# Altium schematic sheet RS422_point_to_point.SchDoc: MODBUS RS485
size A4; Date: *******; ApprovedBy: *******; CheckedBy: None; Author: *******; CompanyName: *******; DrawnBy: Name; Engineer: *******; Organization: *******; Address1: *******; Address2: *******; Address3: *******; Address4: *******; DocumentNumber: Doc Num; Revision: *******; SheetNumber: 7; SheetTotal: 10; CurrentTime: *******; CurrentDate: *******; Time: *******; DocumentFullPathAndName: *******; DocumentName: *******; ModifiedDate: *******; ImagePath: *******; ProjectName: *******; Application_BuildNumber: *******
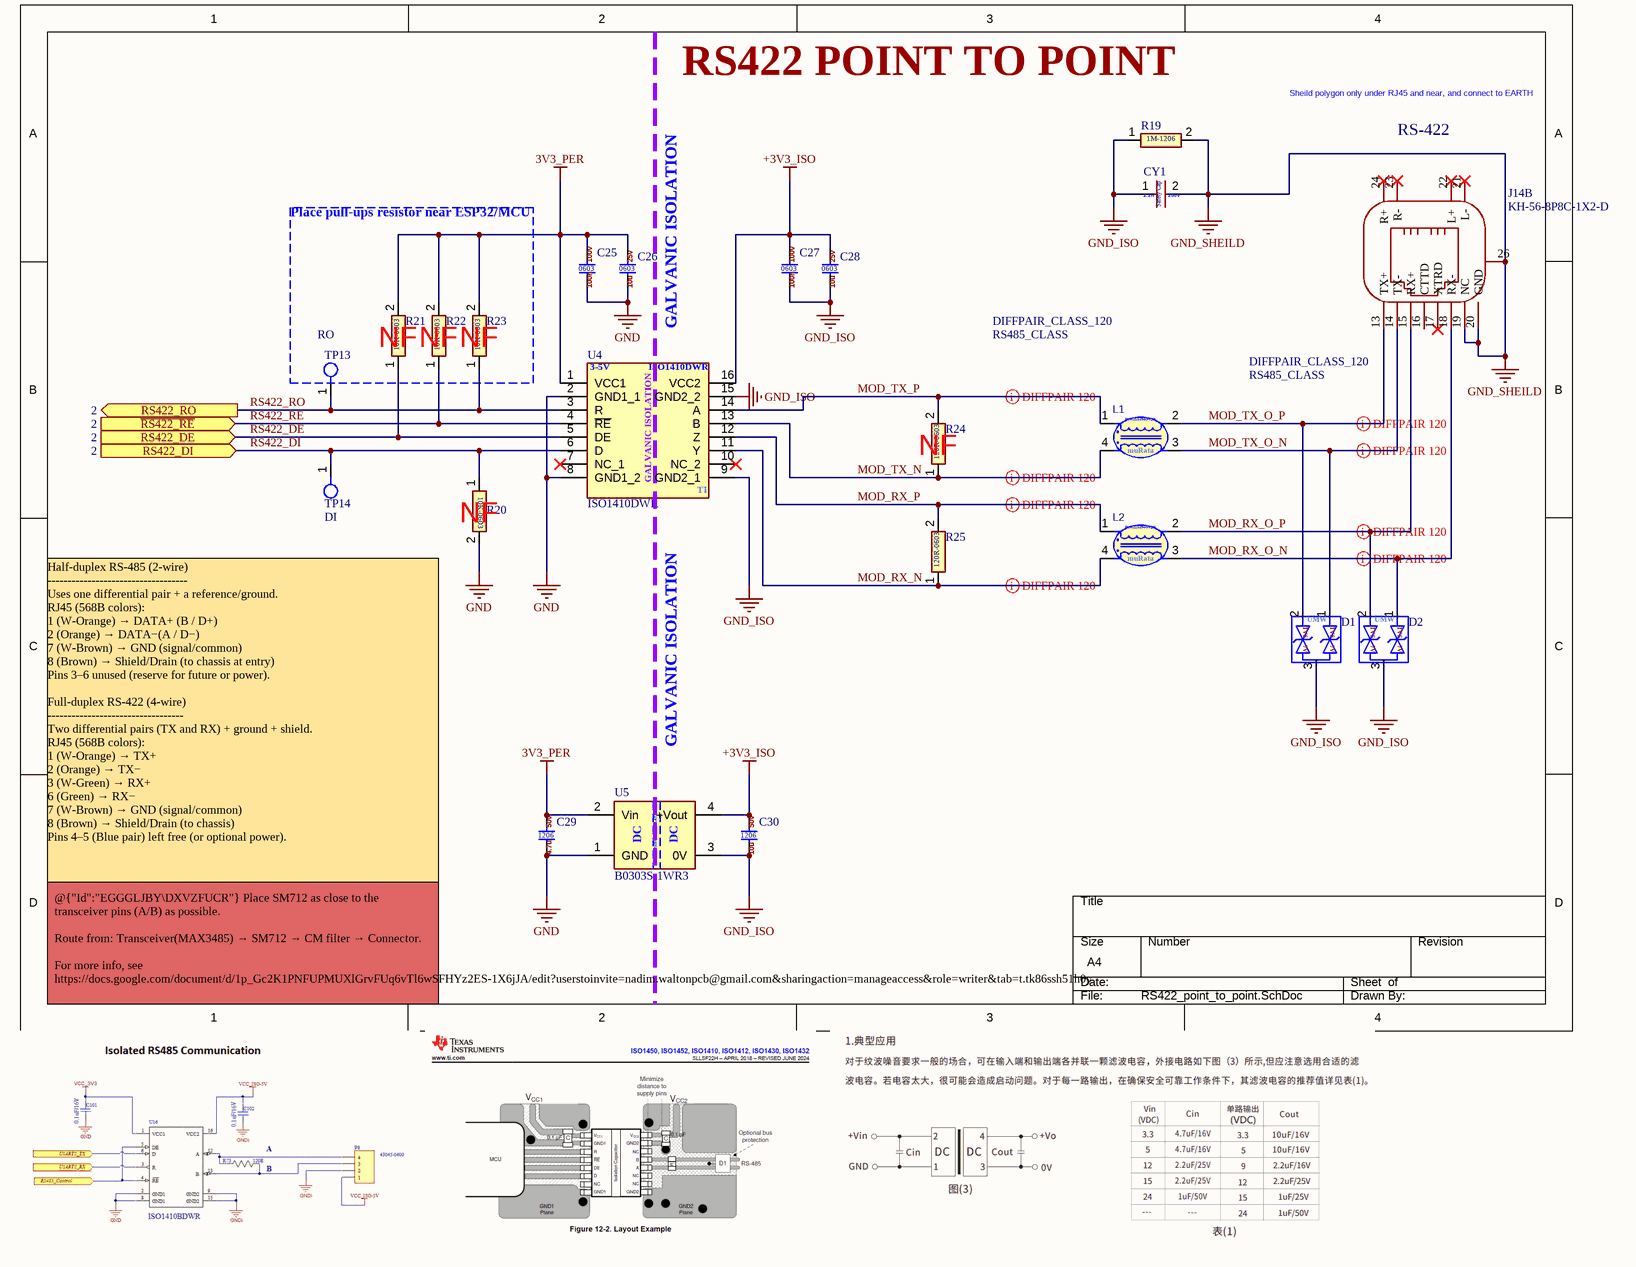
[diagram p0: RS422_point_to_point.SchDoc]

## Parts
C25  CL10B104KC8NNNC  [0603-CAP]  (value not drawn)
C26  CL10A106MA8NRNC  [0603-CAP]  (value not drawn)
C27  CL10B104KC8NNNC  [0603-CAP]  (value not drawn)
C28  CL10A106MA8NRNC  [0603-CAP]  (value not drawn)
C29  CL31B475KBHNNNE  [1206-CAP]  (value not drawn)
C30  CL31A106KBHNNNE  [1206-CAP]  (value not drawn)
CY1  G08F1E222MN0B0S0N0  [CAP_SAFETY_P7.5MM]  (value not drawn)
D1  SM712(UMW)  [SOT-23-3]  (value not drawn)
D2  SM712(UMW)  [SOT-23-3]  (value not drawn)
J14  KH-56-8P8C-1X2-D  [RJ45-TH_KH-56-8P8C-1X2-D]  (part B of 2)
L1  DLW21SZ900HQ2L  [FILTER-SMD_4P-L2.0-W1.2-BL_DLW21H]  (value not drawn)
L2  DLW21SZ900HQ2L  [FILTER-SMD_4P-L2.0-W1.2-BL_DLW21H]  (value not drawn)
R19  1206W4F1004T5E  [1206-RES]  (value not drawn)
R20  0603WAF1002T5E  [0603-RES]  (value not drawn)
R21  0603WAF1002T5E  [0603-RES]  (value not drawn)
R22  0603WAF1002T5E  [0603-RES]  (value not drawn)
R23  0603WAF1002T5E  [0603-RES]  (value not drawn)
R24  0603WAF1200T5E  [0603-RES]  (value not drawn)
R25  0603WAF1200T5E  [0603-RES]  (value not drawn)
TP13  RO  [Test Pad FP]
TP14  DI  [Test Pad FP]
U4  ISO1410DWR  [SOIC-16-300mil]
U5  B0303S-1WR3  [EVISUN B0303S-1WR3]

## Ports
RS422_DE (in, see 2), RS422_DI (in, see 2), RS422_RO (out, see 2), ~{RS422_RE} (in, see 2)

## Nets
3V3_PER: C25.2 C26.2 C29.2 R21.2 R22.2 R23.2 U4.1(VCC1) U5.2(Vin)
+3V3_ISO: C27.2 C28.2 C30.2 U4.16(VCC2) U5.4(+Vout)
GND: C25.1 C26.1 C29.1 R20.2 U4.2(GND1_1) U4.8(GND1_2) U5.1(GND)
GND_ISO: C27.1 C28.1 C30.1 CY1.1 D1.3 D2.3 R19.1 U4.9(GND2_1) U4.15(GND2_2) U5.3(0V)
GND_SHEILD: CY1.2 J14.19(NC) J14.20(GND) J14.26(SHELL) R19.2
MOD_RX_N: L2.4 R25.1 U4.11(Y)
MOD_RX_O_N: D2.1 J14.18(RX-) L2.3
MOD_RX_O_P: D2.2 J14.15(RX+) L2.2
MOD_RX_P: L2.1 R25.2 U4.12(Z)
MOD_TX_N: L1.4 R24.1 U4.13(B)
MOD_TX_O_N: D1.1 J14.14(TX-) L1.3
MOD_TX_O_P: D1.2 J14.13(TX+) L1.2
MOD_TX_P: L1.1 R24.2 U4.14(A)
RS422_DE: R21.1 U4.5(DE) ; port RS422_DE
RS422_DI: R20.1 TP14.1 U4.6(D) ; port RS422_DI
RS422_RE: R22.1 U4.4(~{RE}) ; port ~{RS422_RE}
RS422_RO: R23.1 TP13.1 U4.3(R) ; port RS422_RO

Not connected (* = marked no-connect by the designer): J14 16(CTTD) 17(XTRD)* 21(L-)* 22(L+)* 23(R-)* 24(R+)*; U4 7(NC_1)* 10(NC_2)*

## Layout directives
differential pair; differential pair class DIFFPAIR_CLASS_120; net class RS485_CLASS; rule Matched Net Lengths [Tolerance = 0.5mm]: MOD_RX_N, MOD_RX_O_N, MOD_RX_O_P, MOD_RX_P, MOD_TX_N, MOD_TX_O_N, MOD_TX_O_P, MOD_TX_P

## Notes on the sheet
- RS422 POINT TO POINT
- Sheild polygon only under RJ45 and near, and connect to EARTH
- RS-422
- Place pull-ups resistor near ESP32/MCU
- (near R21) NF
- (near R22) NF
- (near R23) NF
- GALVANIC ISOLATION
- (near R24) NF
- (near R20) NF
- (near R20) Half-duplex RS-485 (2-wire)
  -----------------------------------
  Uses one differential pair + a reference/ground.
  RJ45 (568B colors):
  1 (W-Orange) → DATA+ (B / D+)
  2 (Orange) → DATA−(A / D−)
  7 (W-Brown) → GND (signal/common)
  8 (Brown) → Shield/Drain (to chassis at entry)
  Pins 3–6 unused (reserve for future or power).
  Full-duplex RS-422 (4-wire)
  ----------------------------------
  Two differential pairs (TX and RX) + ground + shield.
  RJ45 (568B colors):
  1 (W-Orange) → TX+
  2 (Orange) → TX−
  3 (W-Green) → RX+
  6 (Green) → RX−
  7 (W-Brown) → GND (signal/common)
  8 (Brown) → Shield/Drain (to chassis)
  Pins 4–5 (Blue pair) left free (or optional power).
- @{"Id":"EGGGLJBY\DXVZFUCR"} Place SM712 as close to the transceiver pins (A/B) as possible.
  Route from: Transceiver(MAX3485) → SM712 → CM filter → Connector.
  For more info, see https://docs.google.com/document/d/1p_Gc2K1PNFUPMUXlGrvFUq6vTl6wSFHYz2ES-1X6jJA/edit?userstoinvite=nadim.waltonpcb@gmail.com&sharingaction=manageaccess&role=writer&tab=t.tk86ssh51h0y
- DWG. NO.
- REV.
- SHT.
- THIS DOCUMENT AND THE DATA DISCLOSED HEREIN OR HEREWITH IS THE PROPERTY OF ALTIUM LIMITED AND MAY BE FREELY DISTRIBUTED IN WHOLE. NO RIGHTS ARE RESERVED OR EXPRESS OR IMPLIED WARANTEE GIVEN.
- REVISION
- DESCRIPTION
- DATE
- APPROVED
- ENG:
- APPROVALS
- PROJECT
- DSN:
- CHK:
- REFERENCE DOCUMENTS
- PROJECT REVISION:
- TITLE
- DOCUMENT REVISION:
- DESIGN ITEM:
- BOM:
- FAB DWG:
- PCB DWG:
- ASSY DWG:
- SCALE:
- SIZE
- B
- CAGE CODE
- FILE NAME
- DWG NO.
- SHEET
- OF
- REV
- (in symbol 0603WAF1002T5E) 10K-0603
- (in symbol 0603WAF1200T5E) 120R-0603
- (in symbol 1206W4F1004T5E) 1M-1206
- (in symbol B0303S-1WR3) ISOLATION; DC
- (in symbol CL10A106MA8NRNC) 25v; 0603; 10u
- (in symbol CL10B104KC8NNNC) 100v; 0603; 100n
- (in symbol CL31A106KBHNNNE) 50v; 1206; 10u
- (in symbol CL31B475KBHNNNE) 50v; 1206; 4.7u
- (in symbol DLW21SZ900HQ2L) muRata
- (in symbol G08F1E222MN0B0S0N0) 2.2n; 250v; Safety Cap
- (in symbol ISO1410DWR) 3-5V; GALVANIC ISOLATION; TI
- (in symbol SM712(UMW)) TVS; UMW; 7V

## Library data of the parts
C25 C27 = CL10B104KC8NNNC: CAP: CER 100NF 100V X7R 0603; POC Price: 0.006; LCSC Part #: C15725; Unit Price: 0.0036; ComponentLink1Description: DS; ComponentLink1URL: https://www.lcsc.com/datasheet/C15725.pdf
C26 C28 = CL10A106MA8NRNC: CAP: CER 10UF 25V X5R 0603; LCSC Part #: C96446; Unit Price: 0.01; ComponentLink1Description: DS; ComponentLink1URL: https://www.lcsc.com/datasheet/C96446.pdf
C29 = CL31B475KBHNNNE: CAP: CER 4.7UF 50V X7R 1206; LCSC Part #: C51205; Unit Price: 0.0177
C30 = CL31A106KBHNNNE: CAP: CER 10UF 35V X5R 1206; LCSC Part #: C13585; Unit Price: 0.0177
CY1 = G08F1E222MN0B0S0N0: CAP SAFETY: 2.2nF ±20% 250V TH P7.5mm; POC Price: 0.0416; LCSC Part #: C240878; Unit Price: 0.0201; ComponentLink1Description: DS; ComponentLink1URL: https://www.lcsc.com/datasheet/C240878.pdf
D1 D2 = SM712(UMW): DIODE TVS: 7V WM 11VC Voltage - Breakdown (Min) 6V / SOT-23; LCSC Part #: C7436899; Unit Price: 0.0183; ComponentLink1Description: DS; ComponentLink1URL: https://www.lcsc.com/datasheet/C7436899.pdf
J14 = KH-56-8P8C-1X2-D_1: RJ45: RJ45 Jack 2 Shielded Right Angle With LED 0℃~+70℃ Through Hole,Right Angle Ethernet Connectors / Modular Connectors (RJ45 RJ11) ROHS; LCSC Part #: C2828088; Unit Price: 0.3505; ComponentLink1Description: DS; ComponentLink1URL: https://www.lcsc.com/datasheet/C2828088.pdf
L1 L2 = DLW21SZ900HQ2L: Filter CM: 90Ω@100MHz 410mΩ 2 0805 Common Mode Filters ROHS; POC Price: 0.1002; LCSC Part #: C161093; Unit Price: 0.0475; ComponentLink1Description: DS; ComponentLink1URL: https://www.lcsc.com/datasheet/C161093.pdf
R19 = 1206W4F1004T5E: RES: 1M OHM 1% 1/4W / 1206; POC Price: 0.0028; LCSC Part #: C17927; Unit Price: 0.0014; ComponentLink1Description: DS; ComponentLink1URL: https://www.lcsc.com/datasheet/C17927.pdf
R20-R23 = 0603WAF1002T5E: RES: 10K OHM 1% 100mW 0603 75V; LCSC Part #: C25804; Unit Price: 0.0005; ComponentLink1Description: DS; ComponentLink1URL: https://www.lcsc.com/datasheet/C25804.pdf
R24 R25 = 0603WAF1200T5E: RES: 120R OHM 1% 100mW 0603 75V; LCSC Part #: C22787; Unit Price: 0.0006; ComponentLink1Description: DS; ComponentLink1URL: https://www.lcsc.com/datasheet/C22787.pdf
TP13 TP14 = Test Pad: TESTPAD: Test Pad
U4 = ISO1410DWR: MODBUS: Galvanic Isolated 3-5V Full and Half-Duplex RS-485 RS-422 Transceivers; POC Price: 3.5376; LCSC Part #: C2671566; Unit Price: 2.1999; ComponentLink1Description: DS; ComponentLink1URL: https://www.ti.com/lit/ds/symlink/iso1410.pdf?ts=1756305081744&ref_url=https%253A%252F%252Fwww.ti.com%252Fproduct%252FISO1410%252Fpart-details%252FISO1410DWR
U5 = B0303S-1WR3: SMPS ISO: DC-DC modular power supply, 1W, fixed voltage input, isolated non-regulated single-channel output SIP,11.7x6mm; POC Price: 0.8117; LCSC Part #: C7465185; Unit Price: 0.4797; ComponentLink1Description: DS; ComponentLink1URL: https://www.lcsc.com/datasheet/C7465185.pdf